# EAGLE design Trigger_Remote_Agilent-combi (EAGLE 8.4.1)
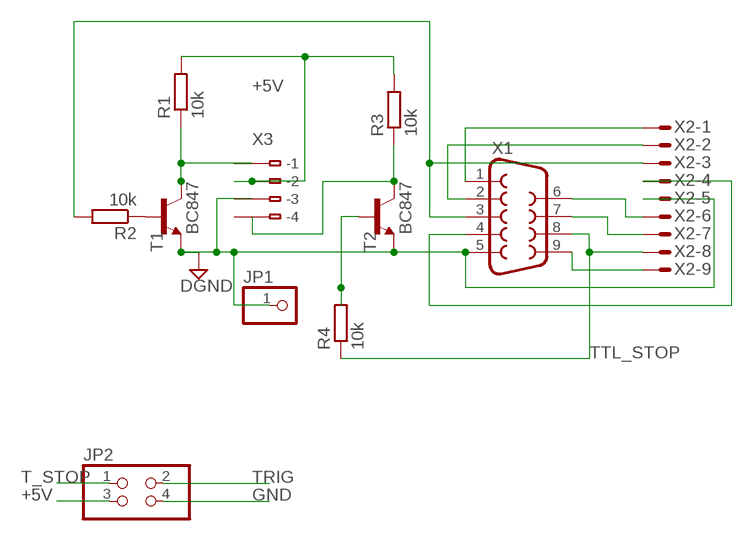
[diagram p0: schematic, sheet 1]

## Parts
JP1  PINHD-1X1  [1X01]
JP2  PINHD-2X2  [2X02]
R1  10k  R-EU_M0805  [M0805]
R2  10k  R-EU_M0805  [M0805]
R3  10k  R-EU_M0805  [M0805]
R4  10k  R-EU_M0805  [M0805]
T1  BC847  [SOT23]
T2  BC847  [SOT23]
X1  F09HP  [F09HP]
X2  M09HPS  [M09HP]
X3  233-504  [233-504]

## Nets
+5V: JP2.3 R1.2 R3.2 X3.A2(-2) X3.B2(B-2)
GND: JP1.1 JP2.4 T1.2(E) T2.2(E) X1.5 X2.5 X3.A3(-3) ; supply symbol labelled DGND
N$1: X1.1 X2.1
N$2: X1.2 X2.2
N$4: X1.4 X2.4
N$5: R2.1 T1.1(B)
N$6: X1.9 X2.9
N$8: X1.7 X2.7
N$9: X1.6 X2.6
N$10: R4.2 T2.1(B)
T_STOP: JP2.1 R3.1 T2.3(C) X3.A4(-4)
TRIG: JP2.2 R1.1 T1.3(C) X3.A1(-1)
TTL_STOP: R4.1 X1.8 X2.8
TTLSTART: R2.2 X1.3 X2.3
Unconnected: X3.B1(B-1) X3.B3(B-3) X3.B4(B-4)

## Library data of the parts
JP1 = pinhead:PINHD-1X1: PIN HEADER
JP2 = pinhead:PINHD-2X2: PIN HEADER
R1-R4 = rcl:R-EU_: RESISTOR, European symbol; SPICEPREFIX: R
T1 T2 = transistor:BC847: NPN TRANSISTOR
X1 = con-subd:F09: SUB-D; OC_FARNELL: unknown; OC_NEWARK: unknown
X2 = con-subd:M09?S: SUB-D; OC_FARNELL: unknown; OC_NEWARK: unknown
X3 = con-wago:233-504: WAGO Cage Clamp; MF: Wago Corporation; MPN: 0233-0504; OC_FARNELL: 1777098; OC_NEWARK: 79K2050

## Board
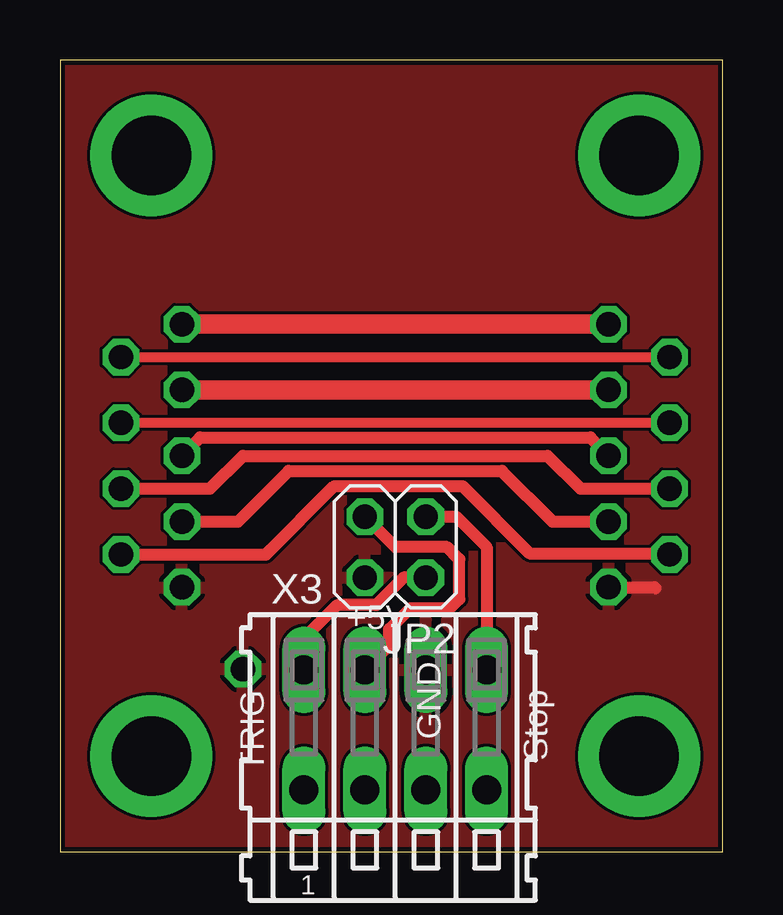
[diagram p1: board, top side]
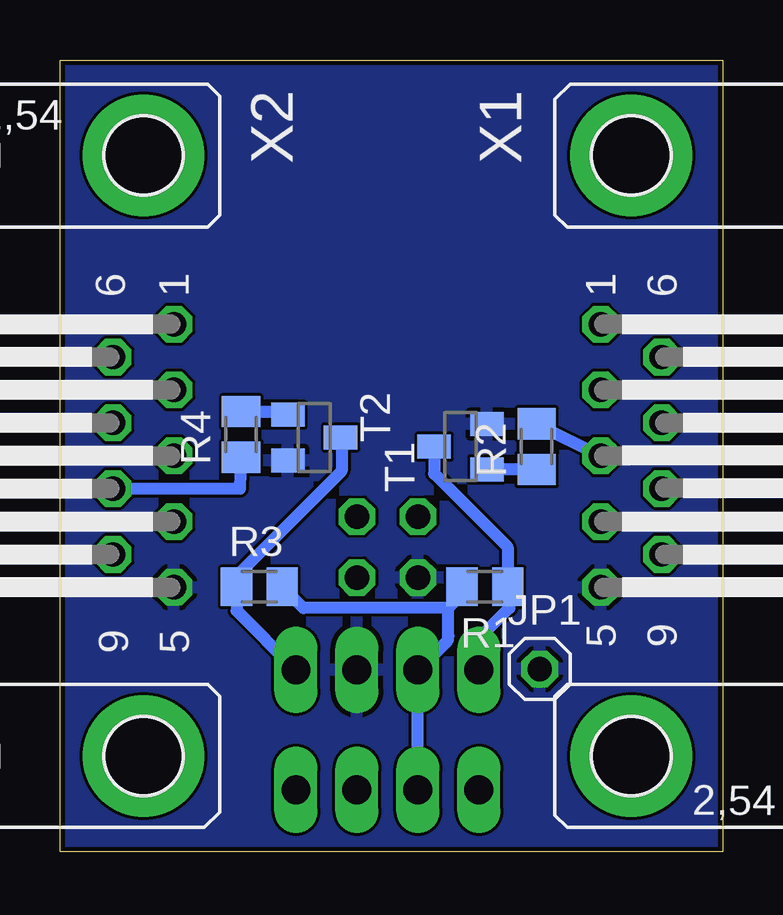
[diagram p2: board, bottom side, seen from below]

Size 27.61 x 33.01 mm. Coordinates in mm from the lower left corner, seen from the top.
Outline: 0,0 27.61,0 27.61,33.01 0,33.01 0,0
Copper layers (1*16): Top 0.018mm / dielectric 1.55mm / Bottom 0.018mm
Design rules "Multi-CB_2L_125um-Tracks_OL35um": minimum track width 0.125mm, minimum drill 0.2mm, track to track 0.125mm, track to pad 0.125mm, pad to pad 0.125mm, via to via 0.125mm, smd to smd 0mil, copper to edge 0.2mm, drill to drill 0.2mm, minimum pad ring 0.125mm, minimum via ring 0.125mm, stop-mask expansion 2mil, vias tented up to drill 0.45mm, thermal gap 0.2mm

### Footprints (pad centres in the part's own frame; a part is rotated, then mirrored left to right if it is on the bottom)
1X01 = drill 1.016 octagon: 1 0,0
2X02 = drill 1.016 octagon: 1 -1.27,-1.27; 2 -1.27,1.27; 3 1.27,-1.27; 4 1.27,1.27
M0805 = smd 1.3 x 1.6: 1 -0.95,0; 2 0.95,0
SOT23 = smd 1 x 1.4: 1 -0.95,-1.1; 2 0.95,-1.1; 3 0,1.1
F09HP = drill 1.016 octagon: 1 -5.486,-1.27; 2 -2.743,-1.27; 3 0,-1.27; 4 2.743,-1.27; 5 5.486,-1.27; 6 -4.115,1.27; 7 -1.372,1.27; 8 1.372,1.27; 9 4.115,1.27 | drill 3.302 pad 5.08: G1 -12.522,0; G2 12.522,0
M09HP = drill 1.016 octagon: 1 -5.486,1.27; 2 -2.743,1.27; 3 0,1.27; 4 2.743,1.27; 5 5.486,1.27; 6 -4.115,-1.27; 7 -1.372,-1.27; 8 1.372,-1.27; 9 4.115,-1.27 | drill 3.302 pad 5.08: G1 -12.522,0; G2 12.522,0
233-504 = drill 1.2 long: A1 -3.81,2.5; A2 -1.27,2.5; A3 1.27,2.5; A4 3.81,2.5; B1 -3.81,-2.5; B2 -1.27,-2.5; B3 1.27,-2.5; B4 3.81,-2.5

### Placement (x,y rotation side)
JP1  7.62,7.62 0 bottom
JP2  13.97,12.7 180 top
R1  9.91,11.05 180 bottom
R2  7.75,16.89 90 bottom
R3  19.3,11.05 0 bottom
R4  20.07,17.4 90 bottom
T1  10.92,16.89 90 bottom
T2  17.02,17.27 270 bottom
X1  3.81,16.51 270 bottom
X2  24.13,16.51 270 bottom
X3  13.97,5.08 0 top

### Tracks (layer width: path | path; a pad name or v marks a point on that pad's centre or on a via)
+5V
  Top 0.508: X3.A2 13.72,8.6 13.72,9.27 14.61,10.16 16.26,10.16 16.64,10.54 16.64,12.19 16.13,12.7 13.97,12.7 JP2.3
  Bottom 0.508: X3.B2 X3.A2 | 12.13,8.15 X3.A2 | R3.2 17.46,10.16 11.43,10.16 | 11.43,10.16 10.86,10.73 R1.2 | X3.A2 11.44,8.84 11.44,9.01 11.43,9.02 11.43,10.16
GND
  Top 0.508: 24.81,10.98 24.77,11.02 X2.5
  pour Top: -8.89,33.02 36.83,33.02 36.83,0 -8.89,0
  pour Bottom: -11.43,34.29 -11.43,-2.54 40.64,-2.54 40.64,35.56 -11.43,35.56
N$1
  Top 0.813: X1.1 X2.1
N$2
  Top 0.813: X1.2 X2.2
N$4
  Top 0.508: X1.4 7.42,13.77 9.53,15.88 18.41,15.88 20.52,13.77 X2.4
N$5
  Bottom 0.508: R2.1 T1.1
N$6
  Top 0.508: X1.9 8.58,12.39 11.43,15.24 16.76,15.24 19.56,12.45 25.35,12.45 X2.9
N$8
  Top 0.406: X2.7 X1.7
N$9
  Top 0.406: X1.6 X2.6
N$10
  Bottom 0.508: R4.2 18.24,18.35 T2.1
T_STOP
  Top 0.508: JP2.1 16.51,13.97 17.78,12.7 X3.A4
  Bottom 0.508: X3.A4 20.25,10.05 R3.1 20.25,11.5 15.88,15.88 15.88,17.23 T2.3
TRIG
  Top 0.508: JP2.2 14.31,11.43 13.17,10.29 11.56,10.29 10.16,8.89 X3.A1
  Bottom 0.508: 10.23,7.65 X3.A1 10.16,8.89 8.89,10.16 8.89,10.98 R1.1 8.96,12.7 12.02,15.77 T1.3
TTL_STOP
  Top 0.508: X1.8 6.25,15.14 7.62,16.51 20.32,16.51 21.69,15.14 X2.8
  Bottom 0.508: X2.8 20.11,15.14 R4.1
TTLSTART
  Top 0.508: X1.3 5.84,17.27 22.1,17.27 X2.3
  Bottom 0.508: X1.3 7.69,17.78 R2.2

### Text on the board
tNames: +5V | GND | TRIG | Stop